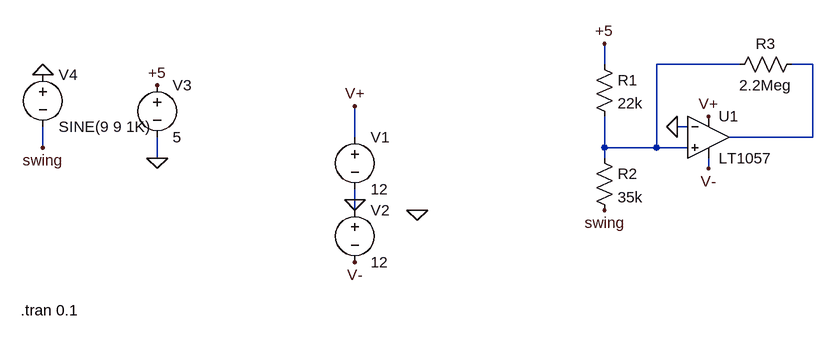
[diagram p0: schematic tap_switch.asc]
tap_switch.asc, the LTspice schematic file:
Version 4
SHEET 1 880 680
WIRE 352 80 352 48
WIRE 560 80 432 80
WIRE 672 80 640 80
WIRE 480 176 464 176
WIRE -32 192 -32 144
WIRE 672 192 672 80
WIRE 672 192 544 192
WIRE -512 208 -512 176
WIRE 352 208 352 160
WIRE 432 208 432 80
WIRE 432 208 352 208
WIRE 480 208 432 208
WIRE -336 224 -336 192
WIRE 352 224 352 208
WIRE 512 240 512 224
WIRE -32 288 -32 272
WIRE -32 304 -32 288
FLAG 64 304 0
FLAG -32 144 V+
FLAG 512 160 V+
FLAG -32 384 V-
FLAG 512 240 V-
FLAG -32 288 0
FLAG -336 224 0
FLAG -336 112 +5
FLAG 352 48 +5
FLAG -512 96 0
FLAG -512 208 swing
FLAG 352 304 swing
FLAG 464 176 0
SYMBOL Opamps\\LT1057 512 128 R0
SYMATTR InstName U1
SYMBOL voltage -32 176 R0
WINDOW 123 0 0 Left 0
WINDOW 39 0 0 Left 0
SYMATTR InstName V1
SYMATTR Value 12
SYMBOL voltage -32 288 R0
WINDOW 123 0 0 Left 0
WINDOW 39 0 0 Left 0
SYMATTR InstName V2
SYMATTR Value 12
SYMBOL voltage -336 96 R0
WINDOW 123 0 0 Left 0
WINDOW 39 0 0 Left 0
SYMATTR InstName V3
SYMATTR Value 5
SYMBOL voltage -512 80 R0
WINDOW 123 0 0 Left 0
WINDOW 39 0 0 Left 0
SYMATTR InstName V4
SYMATTR Value SINE(9 9 1K)
SYMBOL res 336 64 R0
SYMATTR InstName R1
SYMATTR Value 22k
SYMBOL res 336 208 R0
SYMATTR InstName R2
SYMATTR Value 35k
SYMBOL res 656 64 R90
WINDOW 0 0 56 VBottom 2
WINDOW 3 32 56 VTop 2
SYMATTR InstName R3
SYMATTR Value 2.2Meg
TEXT -546 458 Left 2 !.tran 0.1

The netlist it stands for:
* tap_switch.asc
XU1 N001 0 V+ V- N002 LT1057  ; pins In+ In- V+ V- OUT
V1 V+ 0 12
V2 0 V- 12
V3 +5 0 5
V4 0 swing SINE(9 9 1K)
R1 +5 N001 22k
R2 N001 swing 35k
R3 N002 N001 2.2Meg
.tran 0.1
.lib LTC.lib
.backanno
.end